# EAGLE design avga_TTH (EAGLE 7.5.0)
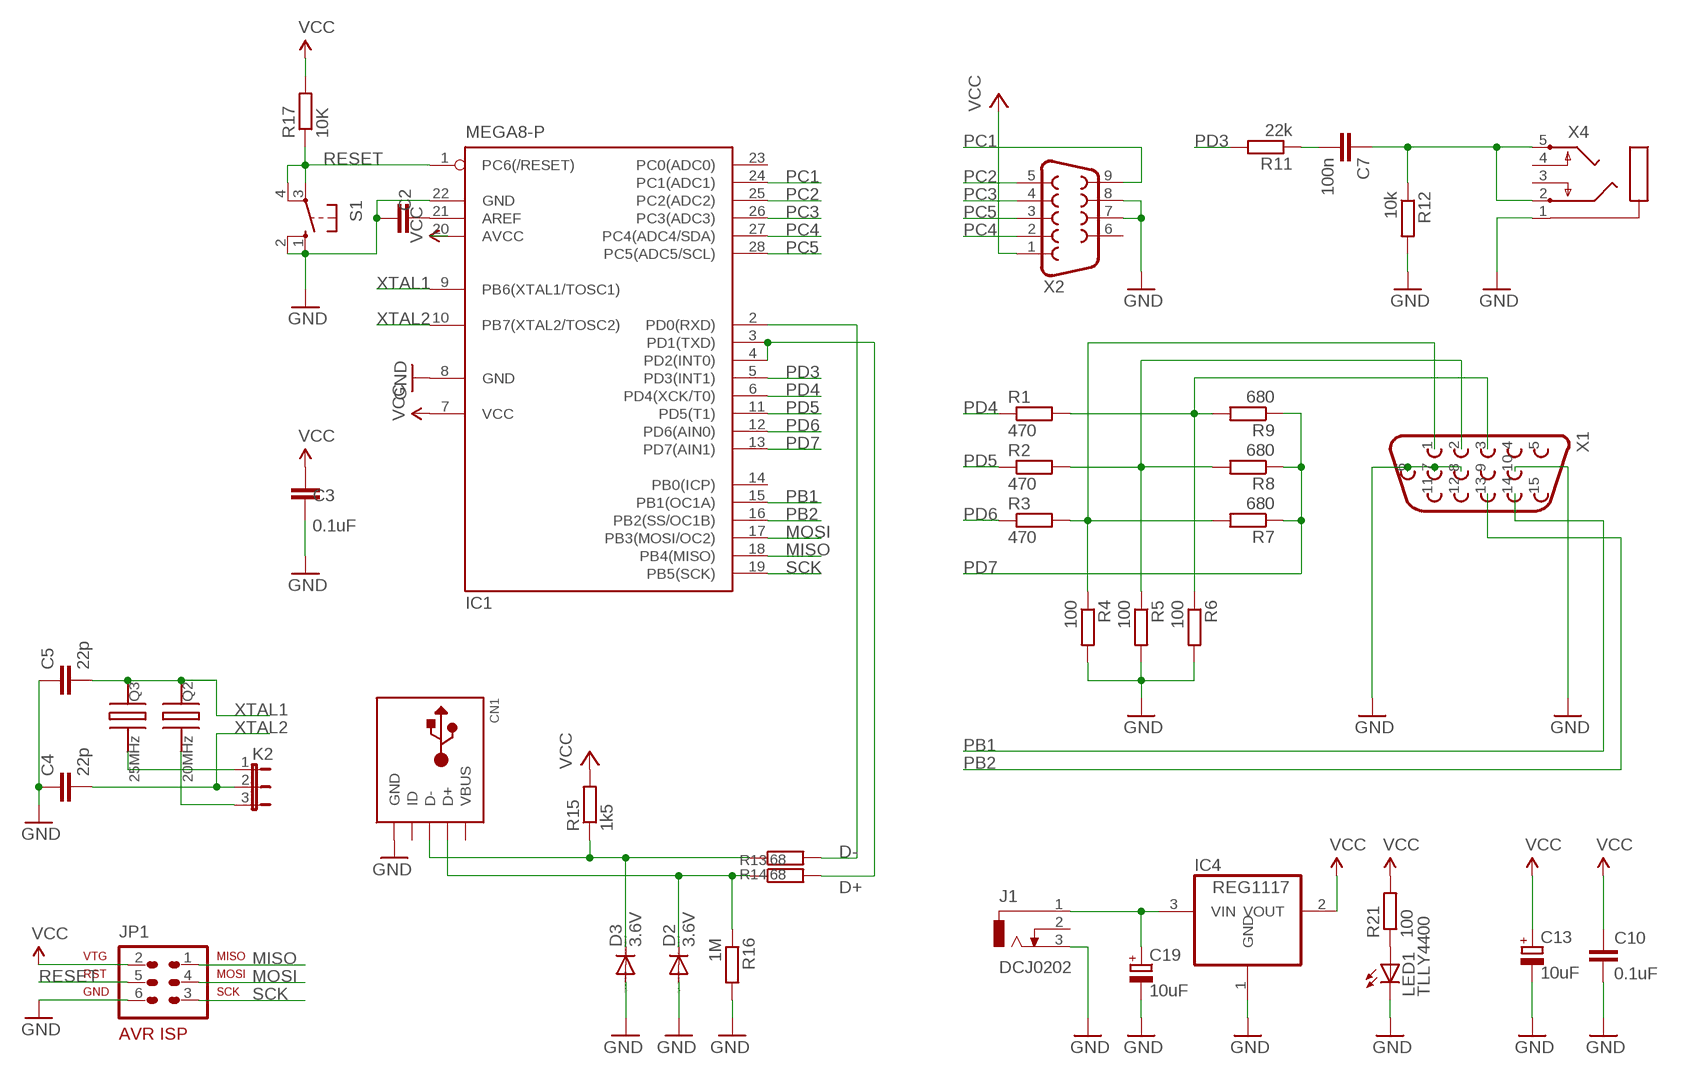
[diagram p0: schematic, sheet 1]

## Parts
C2  0.1uF  C-EUC0805  [C0805]
C3  0.1uF  C-EUC0805  [C0805]
C4  22p  C-EUC0805  [C0805]
C5  22p  C-EUC0805  [C0805]
C7  100n  C-EUC0805  [C0805]
C10  0.1uF  C-EUC0805  [C0805]
C13  10uF  CPOL-EUE2.5-5  [E2,5-5]
C19  10uF  CPOL-EUE2.5-5  [E2,5-5]
CN1  USBMINIB  [USB-MINIB]
D2  3.6V  DIODE-MINIMELF  [MINIMELF]
D3  3.6V  DIODE-MINIMELF  [MINIMELF]
IC1  MEGA8-P  [DIL28-3]
IC4  REG1117  [SOT223]
J1  DCJ0202  [DCJ0202]
JP1  AVR-ISP-6R  [AVR-ISP-6R]
K2  CON-3-POL  [MOLEX-PSK-03]
LED1  TLLY4400  [LED3MM]
Q2  20MHz  QUARZ  [QUARZ]
Q3  25MHz  QUARZ  [QUARZ]
R1  470  R-EU_R0805  [R0805]
R2  470  R-EU_R0805  [R0805]
R3  470  R-EU_R0805  [R0805]
R4  100  R-EU_R0805  [R0805]
R5  100  R-EU_R0805  [R0805]
R6  100  R-EU_R0805  [R0805]
R7  680  R-EU_R0805  [R0805]
R8  680  R-EU_R0805  [R0805]
R9  680  R-EU_R0805  [R0805]
R11  22k  R-EU_R0805  [R0805]
R12  10k  R-EU_R0805  [R0805]
R13  68  R-EU_R0805  [R0805]
R14  68  R-EU_R0805  [R0805]
R15  1k5  R-EU_R0805  [R0805]
R16  1M  R-EU_R0805  [R0805]
R17  10K  R-EU_R0805  [R0805]
R21  100  R-EU_R0805  [R0805]
S1  10-XX  [B3F-10XX]
X1  VGA-BU-15POL  [VGA-BU-15POL]
X2  D-SUB-ST-9POL  [M09HP]
X4  KLINKENBUCHSE  [KLINKENBUCHSE]

## Nets
B: R1.2 R6.1 R9.2 X1.3
G: R2.2 R5.1 R8.2 X1.2
GND: C2.2 C3.1 C4.1 C5.1 C10.2 C13.- C19.- CN1.GND D2.A D3.A IC1.8(GND) IC1.22(GND) IC4.1(GND) J1.3 JP1.6 LED1.K(C) R4.2 R5.2 R6.2 R12.2 R16.2 S1.1(S) S1.2(S1) X1.6 X1.7 X1.8 X1.10 X2.7 X2.8 X4.1
MISO: IC1.18(PB4(MISO)) JP1.1
MOSI: IC1.17(PB3(MOSI/OC2)) JP1.4
N$1: LED1.A R21.1
N$2: C7.1 R12.1 X4.2 X4.5
N$3: K2.1 Q3.2
N$11: CN1.D+ D2.C R13.1 R16.1
N$13: CN1.D- D3.C R14.1 R15.1
N$14: C7.2 R11.1
N$15: IC1.3(PD1(TXD)) IC1.4(PD2(INT0)) R13.2
N$16: IC1.2(PD0(RXD)) R14.2
N$19: K2.3 Q2.2
N$31: C2.1 IC1.21(AREF)
PB1: IC1.15(PB1(OC1A)) X1.14
PB2: IC1.16(PB2(SS/OC1B)) X1.13
PC1: IC1.24(PC1(ADC1)) X2.9
PC2: IC1.25(PC2(ADC2)) X2.5
PC3: IC1.26(PC3(ADC3)) X2.4
PC4: IC1.27(PC4(ADC4/SDA)) X2.2
PC5: IC1.28(PC5(ADC5/SCL)) X2.3
PD3: IC1.5(PD3(INT1)) R11.2
PD4: IC1.6(PD4(XCK/T0)) R1.1
PD5: IC1.11(PD5(T1)) R2.1
PD6: IC1.12(PD6(AIN0)) R3.1
PD7: IC1.13(PD7(AIN1)) R7.1 R8.1 R9.1
R: R3.2 R4.1 R7.2 X1.1
RESET: IC1.1(PC6(/RESET)) JP1.5 R17.1 S1.3(P) S1.4(P1)
SCK: IC1.19(PB5(SCK)) JP1.3
VCC: C3.2 C10.1 C13.+ IC1.7(VCC) IC1.20(AVCC) IC4.2(VOUT) JP1.2 R15.2 R17.2 R21.2 X2.1
VIN [vcc]: C19.+ IC4.3(VIN) J1.1
XTAL1: C5.2 IC1.9(PB6(XTAL1/TOSC1)) Q2.1 Q3.1
XTAL2: C4.2 IC1.10(PB7(XTAL2/TOSC2)) K2.2
Unconnected: CN1.ID IC1.14(PB0(ICP)) IC1.23(PC0(ADC0)) J1.2 X1.4 X1.5 X1.9 X1.11 X1.12 X1.15 X2.6 X4.3 X4.4

## Notes on the sheet
- D-
- D+

## Power pins joined to a net without a drawn wire
VBUS: CN1.VBUS

## Library data of the parts
C2 C3 = resistor:C-EU: CAPACITOR, European symbol
C4 C5 C7 C10 = rcl:C-EU: CAPACITOR, European symbol
C13 C19 = rcl:CPOL-EU: POLARIZED CAPACITOR, European symbol
CN1 = adafruit:USB: USB Connectors USBMINIB - Surface Mount Female Mini-B USB Connector 4UConnector: 06564 By microbuilder.eu Thru-hole RA Female Mini-B USB Connector 4UConnector: 18732 By ladyada.net
D2 D3 = diode:DIODE-: DIODE
IC1 = atmel:MEGA8-P: MICROCONTROLLER 8 Kbytes FLASH, 1 kbytes SRAM, 512 bytes EEPROM, USART, 4-channel 10 bit ADC, 2-channel 8 bit ADC Pin compatible with Atmega48, ATMega88, ATMega168 Source: avr.lbr; OC_FARNELL: unknown; OC_NEWARK: unknown
IC4 = burr-brown:REG1117: 800mA and 1A Low Dropout (LDO) Positive Regulator 1.8V, 2.5V, 2.85V, 3.3V, 5V, and Adj; MPN: REG1117; OC_FARNELL: 1097566; OC_NEWARK: 14P6981
J1 = con-jack-igi:DCJ0202: DC POWER JACK Source: DCJ0202.pdf; OC_FARNELL: unknown; OC_NEWARK: unknown
JP1 = avr-6:AVR-ISP-6: AVR ISP-6 Serial Programming Header
K2 = usbswitchboard:CON-3-POL: JST Stiftleiste B3B-EH-A
LED1 = led-igi:TLLY4400: Low Current (2mA) LED 3 mm Tinted Diffused Package color YELLOW Source: Data sheet <http://www.farnell.com/datasheets/391098.pdf>; MF: VISHAY SEMICONDUCTOR; OC_FARNELL: 1612439
Q2 Q3 = pacman:QUARZ: Quarz
R1-R9 R11-R16 = rcl:R-EU_: RESISTOR, European symbol
R17 R21 = resistor:R-EU_: RESISTOR, European symbol
S1 = switch-omron:10-XX: OMRON SWITCH; MPN: B3F-1000; OC_FARNELL: 176432; OC_NEWARK: 36M3542
X1 = usbboard:VGA-BU-15POL: VGA-Buchse 15pol
X2 = pacman:D-SUB-ST-9POL: D-SUB-Stecker, 9-polig, gewinkelt, RM 9,4
X4 = usbboard:KLINKENBUCHSE: Klinkenbuchse 3,5mm stereo

## Net classes
1 vcc: width 0.254 mm

## Board
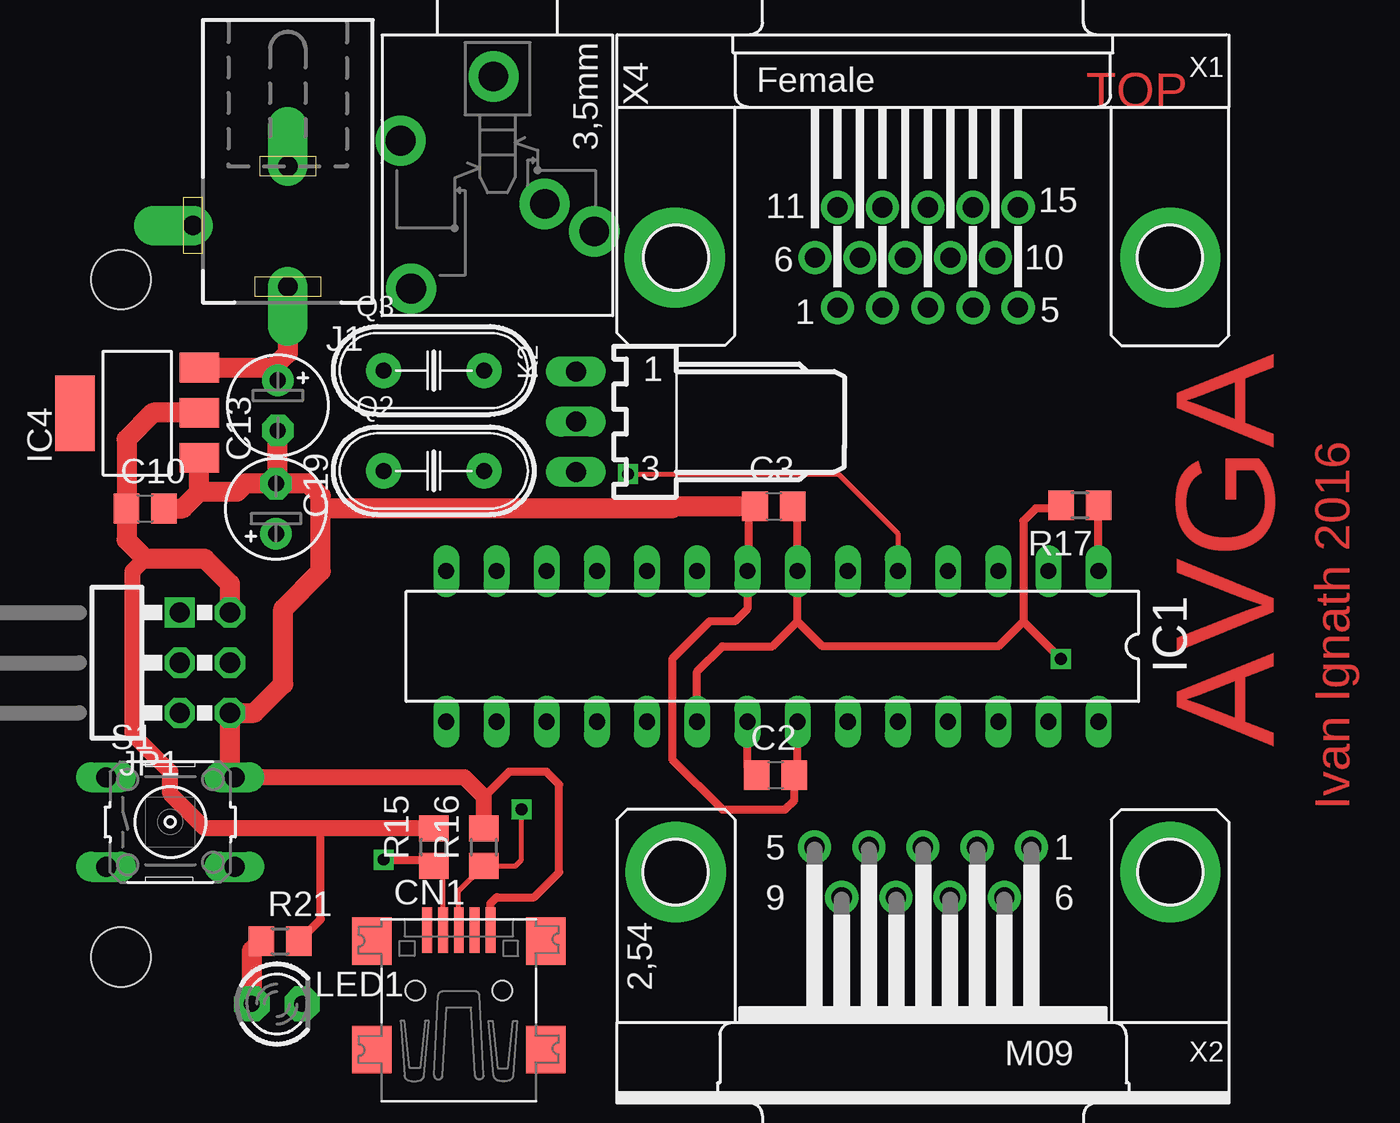
[diagram p1: board, top side]
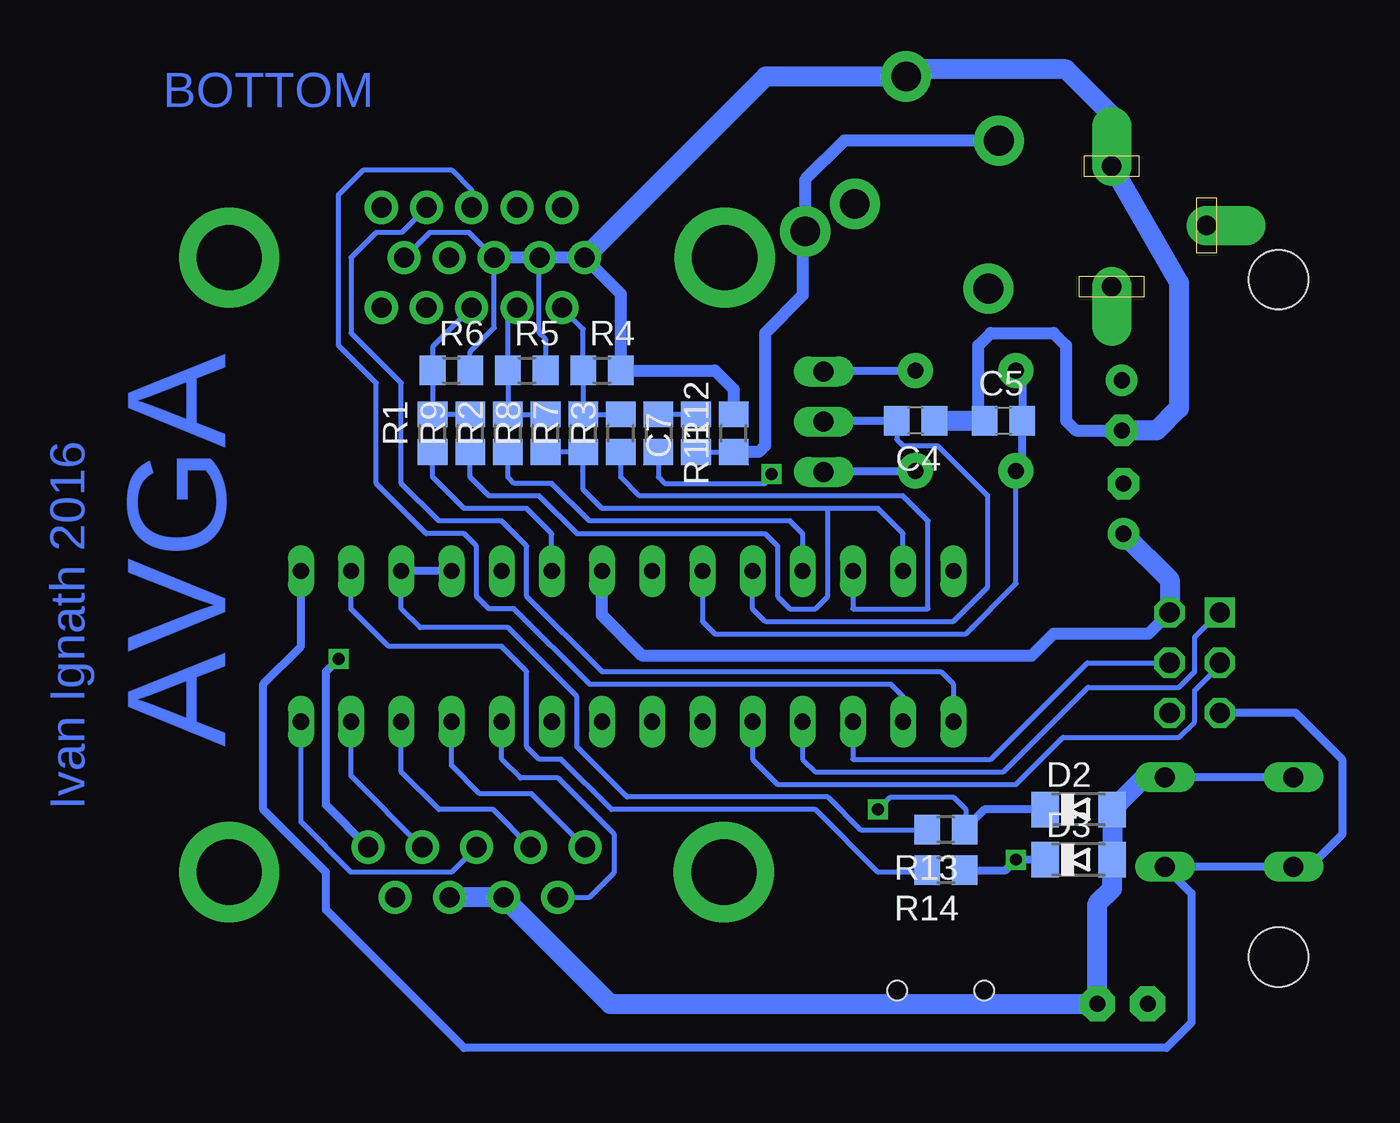
[diagram p2: board, bottom side, seen from below]

No outline drawn. Coordinates in mm, seen from the top.
Copper layers (1*16): Top 0.035mm / dielectric 1.5mm / Bottom 0.035mm
Design rules "default": minimum track width 10mil, minimum drill 24mil, track to track 8mil, track to pad 8mil, pad to pad 8mil, via to via 8mil, smd to smd 8mil, copper to edge 40mil, drill to drill 8mil, minimum pad ring 10mil, minimum via ring 8mil, stop-mask expansion 4mil, vias tented up to drill 0mil, thermal gap 10mil
Holes 3 mm at 77.77,5.87 3.86,5.87 77.77,40.16 3.86,40.16

### Footprints (pad centres in the part's own frame; a part is rotated, then mirrored left to right if it is on the bottom)
C0805 = smd 1.3 x 1.5: 1 -0.95,0; 2 0.95,0
E2,5-5 = drill 0.813 pad 1.6: + -1.27,0 | drill 0.813 pad 1.6 octagon: - 1.27,0
USB-MINIB = smd 0.5 x 2.308: D+ 0,4.064; D- -0.8,4.064; GND 1.6,4.064; ID 0.8,4.064; VBUS -1.6,4.064 | smd 2 x 2.4: GND1 -4.4,-2; GND2 -4.4,3.5; GND3 4.4,3.5; GND4 4.4,-2 | hole 1: -2.2,1; 2.2,1
MINIMELF = smd 1.4 x 1.8: A 1.7,0; C -1.7,0
DIL28-3 = drill 0.813 long: 1 -16.51,-3.81; 2 -13.97,-3.81; 3 -11.43,-3.81; 4 -8.89,-3.81; 5 -6.35,-3.81; 6 -3.81,-3.81; 7 -1.27,-3.81; 8 1.27,-3.81; 9 3.81,-3.81; 10 6.35,-3.81; 11 8.89,-3.81; 12 11.43,-3.81; 13 13.97,-3.81; 14 16.51,-3.81; 15 16.51,3.81; 16 13.97,3.81; 17 11.43,3.81; 18 8.89,3.81; 19 6.35,3.81; 20 3.81,3.81; 21 1.27,3.81; 22 -1.27,3.81; 23 -3.81,3.81; 24 -6.35,3.81; 25 -8.89,3.81; 26 -11.43,3.81; 27 -13.97,3.81; 28 -16.51,3.81
SOT223 = smd 1.499 x 2.007: 1 -2.261,-3.15; 2 0.025,-3.15; 3 2.311,-3.15 | smd 3.81 x 2.007: 4 0,3.15
DCJ0202 = drill 1 pad 2 offset: 1 0,3.1; 2 4.8,0; 3 0,-3
AVR-ISP-6R = drill 1.016 square: 1 -2.54,-1.27 | drill 1.016 octagon: 2 -2.54,1.27; 3 0,-1.27; 4 0,1.27; 5 2.54,-1.27; 6 2.54,1.27
MOLEX-PSK-03 = drill 1.016 long: 1 2.54,0; 2 0,0; 3 -2.54,0
LED3MM = drill 0.813 pad 1.778 octagon: A -1.27,0; K 1.27,0
QUARZ = drill 0.813 pad 1.778: 1 0,0; 2 5.08,0
R0805 = smd 1.3 x 1.5: 1 -0.95,0; 2 0.95,0
B3F-10XX = drill 1.016 long: 1 -3.251,2.261; 2 3.251,2.261; 3 -3.251,-2.261; 4 3.251,-2.261
VGA-BU-15POL = drill 1.016 pad 1.676: 1 4.329,2.54; 2 2.043,2.54; 3 -0.243,2.54; 4 -2.54,2.529; 5 -4.815,2.54; 6 5.472,0; 7 3.186,0; 8 0.9,0; 9 -1.386,0; 10 -3.672,0; 11 4.329,-2.54; 12 2.043,-2.54; 13 -0.243,-2.54; 14 -2.529,-2.54; 15 -4.815,-2.54 | drill 3.302 pad 5.08: G1 -12.522,0; G3 12.56,0
M09HP = drill 1.016 pad 1.676: 1 -5.486,-1.27; 2 -2.743,-1.27; 3 0,-1.27; 4 2.743,-1.27; 5 5.486,-1.27; 6 -4.115,1.27; 7 -1.372,1.27; 8 1.372,1.27; 9 4.115,1.27 | drill 3.302 pad 5.08: G1 -12.522,0; G2 12.522,0
KLINKENBUCHSE = drill 1.499 pad 2.54: 1 -5.004,-0.203; 2 2.845,4.902; 3 1.448,2.388; 4 5.74,-4.369; 5 -1.753,-4.902

### Placement (x,y rotation side)
C2  36.99,15.08 0 top
C3  36.9,28.68 0 top
C4  22.23,33.02 180 bottom
C5  17.78,33.02 0 bottom
C7  33.34,32.38 90 bottom
C10  5.08,28.57 0 top
C13  11.7,28.56 90 top
C19  11.79,33.79 270 top
CN1  20.95,3.17 0 top
D2  13.97,13.34 0 bottom
D3  13.97,10.79 0 bottom
IC1  36.83,21.59 180 top
IC4  4.67,33.4 90 top
J1  12.3,42.9 180 top
JP1  8.1,20.77 270 top
K2  26.88,32.97 90 top
LED1  11.75,3.49 0 top
Q2  17.14,30.48 0 top
Q3  17.14,35.56 0 top
R1  46.67,32.38 90 bottom
R2  42.86,32.38 90 bottom
R3  37.15,32.38 90 bottom
R4  38.1,35.56 0 bottom
R5  41.91,35.56 0 bottom
R6  45.72,35.56 0 bottom
R7  39.05,32.38 90 bottom
R8  40.96,32.38 90 bottom
R9  44.77,32.38 90 bottom
R11  35.24,32.38 270 bottom
R12  31.43,32.38 90 bottom
R13  20.7,12.32 180 bottom
R14  20.69,10.26 180 bottom
R15  19.68,11.43 90 top
R16  22.23,11.43 90 top
R17  52.39,28.73 180 top
R21  11.91,6.67 0 top
S1  6.35,12.7 0 top
X1  44.45,41.27 180 top
X2  44.45,10.16 180 top
X4  22.91,45.44 270 top

### Tracks (layer width: path | path; a pad name or v marks a point on that pad's centre or on a via)
B
  Bottom 0.254: R9.2 R1.2 R6.1 46.67,36.76 X1.3
G
  Bottom 0.254: R8.2 R2.2 R5.1 42.86,38.28 X1.2
GND
  Top 0.254: 35.63,25.47 IC1.8
  Top 0.406: 35.63,25.47 35.63,28.37 C3.1 | IC1.22 38.1,15.24 arc-90 C2.2 37.94,13.81 37.47,13.34 34.29,13.34 31.75,15.88 31.75,20.95 33.66,22.86 34.92,22.86 35.56,23.5 IC1.8 | CN1.GND 22.55,8.57 22.87,8.89 24.77,8.89 26.04,10.16 26.04,14.61 25.4,15.24 23.5,15.24 22.23,13.97
  Top 0.813: R16.2 22.23,13.97 21.23,14.96 S1.2
  Top 1.016: C10.2 6.99,28.57 7.82,29.41 | 7.82,29.41 IC4.1 | 11.69,29.84 C13.- 11.71,29.84 13.34,29.84 13.97,29.21 13.97,28.57 | 11.69,29.84 10.16,29.84 9.73,29.41 7.82,29.41 | 11.69,29.84 11.79,29.95 C19.- | 13.97,28.57 13.97,25.4 12.06,23.5 12.06,19.68 10.61,18.23 JP1.6 9.37,15.2 S1.2 | C3.1 31.86,28.68 31.75,28.57 13.97,28.57
  Bottom 0.254: R5.2 40.96,37.15 41.27,37.47 41.27,41.26 X1.7 | R4.2 37.31,35.72 | X1.10 48.1,41.27 46.83,42.55 44.82,42.55 X1.8 43.55,37.73 44.77,36.51 R6.2 | R12.2 31.11,33.65
  Bottom 0.406: S1.1 S1.2 10.64,14.96
  Bottom 0.61: R12.2 31.43,34.61 32.38,35.56 R4.2 37.15,39.45 X1.6 X1.7 X1.8 | C5.1 19.05,33.34 19.05,36.83 18.41,37.47 15.24,37.47 14.61,36.83 14.61,33.02 14.11,32.52 C19.-
  Bottom 1.016: J1.3 12.52,45.9 | J1.3 12.3,48.49 14.61,50.8 22.35,50.8 X4.1 29.8,50.45 X1.6 | J1.3 8.89,40.01 8.89,33.66 10.02,32.52 C19.- | C4.1 C5.1 | 10.64,14.96 D2.A D3.A 12.27,9.32 13.02,8.57 LED1.K 37.68,3.49 X2.8 X2.7
MISO
  Bottom 0.254: IC1.18 27.94,15.88 27.3,15.24 17.78,15.24 13.49,19.53 8.89,19.53 8.1,20.32 8.1,22.07 6.86,23.31 JP1.1
MOSI
  Bottom 0.254: IC1.17 25.4,15.88 18.41,15.88 13.52,20.77 JP1.4
N$1
  Top 1.016: R21.1 10.48,6.19 LED1.A
N$2
  Bottom 0.254: C7.1 R12.1
  Bottom 0.61: X4.5 25.83,47.2 27.81,45.21 X4.2 27.94,42.47 27.94,39.37 29.84,37.47 29.84,31.75 30.16,31.43 R12.1
N$3
  Bottom 0.406: K2.1 26.83,35.56 Q3.2
N$11  (via drill 0.6)
  Top 0.254: CN1.D+ 20.95,9.21 R16.1 23.82,10.48 24.13,10.79 v24.13,13.34
  Bottom 0.254: 19.5,12.06 R13.1 19.68,12.38 19.68,13.34 20.32,13.97 23.5,13.97 v24.13,13.34
  Bottom 0.406: D2.C 18.73,13.34 R13.1
N$13  (via drill 0.6)
  Top 0.254: CN1.D- 20.16,10.01 R15.1
  Top 0.406: v17.14,10.79 19.37,10.79 R15.1
  Bottom 0.406: D3.C v17.14,10.79 17.68,10.26 R14.1
N$14
  Bottom 0.254: C7.2 R11.1
N$15
  Bottom 0.254: R13.2 25.02,12.31 26.67,13.97 36.83,13.97 39.37,16.51 39.37,19.05 42.86,22.54 47.31,22.54 48.26,23.5 IC1.3
  Bottom 0.406: IC1.4 IC1.3
N$16
  Bottom 0.254: R14.2 21.75,10.16 24.13,10.16 27.3,13.34 37.62,13.34 40.16,15.88 41.27,15.88 41.91,16.51 41.91,20.32 43.18,21.59 48.9,21.59 50.8,23.5 IC1.2
N$19
  Bottom 0.406: K2.3 26.83,30.48 Q2.2
N$31
  Top 0.406: C2.1 arc-90 35.56,15.56 IC1.21
PB1
  Bottom 0.254: X1.14 48.25,42.55 49.53,42.55 50.8,41.27 50.8,37.47 48.26,34.92 48.26,29.84 46.35,27.94 43.18,27.94 41.91,26.67 41.91,24.13 38.1,20.32 20.95,20.32 20.32,19.68 IC1.15
PB2
  Bottom 0.254: X1.13 44.69,44.69 45.72,45.72 50.16,45.72 51.44,44.45 51.44,36.83 49.53,34.92 49.53,29.84 46.99,27.3 45.09,27.3 44.45,26.67 44.45,24.13 43.81,23.5 42.55,23.5 38.73,19.68 23.5,19.68 22.86,19.05 IC1.16
PC1
  Bottom 0.254: X2.9 38.73,8.89 37.47,10.16 37.47,12.06 40.32,14.92 42.23,14.92 43.18,15.88 IC1.24
PC2
  Bottom 0.254: X2.5 41.66,14.13 44.29,14.13 45.72,15.56 IC1.25
PC3
  Bottom 0.254: X2.4 43.61,13.34 46.35,13.34 48.26,15.24 IC1.26
PC4
  Bottom 0.254: X2.2 50.8,15.04 IC1.27
PC5
  Bottom 0.254: 44.44,11.44 X2.3 45.72,10.16 50.8,10.16 53.34,12.7 IC1.28
PD3  (via drill 0.6)
  Top 0.254: v29.53,30.32 40.16,30.32 43.18,27.3 IC1.5
  Bottom 0.254: R11.2 35.24,30.16 34.92,29.84 29.84,29.84 29.53,30.16 v29.53,30.32
PD4
  Bottom 0.254: IC1.6 40.64,27.3 41.91,28.57 45.09,28.57 46.67,30.16 R1.1 46.99,31.12 46.99,31.11
PD5
  Bottom 0.254: R2.1 42.55,31.12 | IC1.11 27.94,27.3 28.57,27.94 38.73,27.94 40.64,29.84 42.55,29.84 42.86,30.16 R2.1 | 43.18,31.11 43.18,31.12 R2.1
PD6
  Bottom 0.254: IC1.12 25.4,23.5 21.59,23.5 21.59,27.94 22.86,29.21 36.2,29.21 37.15,30.16 R3.1
PD7
  Bottom 0.254: R8.1 R7.1 39.05,29.53 38.1,28.57 26.67,28.57 | IC1.13 22.86,27.3 24.13,28.57 26.67,28.57 | 26.67,28.57 26.67,24.13 27.3,23.5 28.57,23.5 29.21,24.13 29.21,26.67 29.84,27.3 39.37,27.3 41.27,29.21 43.81,29.21 44.77,30.16 R9.1 45.09,31.12 45.09,31.11
R
  Bottom 0.254: R3.2 R7.2 R4.1 39.05,37.67 X1.1
RESET
  Top 0.406: IC1.1 R17.1
  Bottom 0.406: JP1.5 2.99,18.23 0.64,15.88 0.64,12.06 2.26,10.44 S1.3 S1.4 8.26,9.09 8.26,2.54 9.53,1.27 45.09,1.27 52.07,8.26 52.07,10.16 55.24,13.34 55.24,19.68 53.34,21.59 IC1.1
SCK
  Bottom 0.254: IC1.19 30.48,15.88 29.21,14.61 17.14,14.61 14.76,16.99 8.89,16.99 8.1,17.78 8.1,19.37 6.83,20.64 JP1.3
VCC  (via drill 0.6)
  Top 0.406: IC1.20 33.02,20.32 34.29,21.59 36.83,21.59 38.1,22.86 | 38.1,22.86 IC1.7 38.1,28.43 C3.2 | R17.2 51.28,28.57 50.16,28.57 49.53,27.94 49.53,22.86 | 49.53,22.86 48.26,21.59 39.37,21.59 38.1,22.86 | R21.2 13.97,7.78 13.97,12.38 | v51.44,20.95 49.53,22.86
  Top 0.813: R15.2 13.97,12.38 8.1,12.38 6.35,14.13 6.35,15.24 4.45,17.14 4.45,25.4 5.08,26.04
  Top 1.016: IC4.2 5.48,33.42 4.13,32.07 C10.1 4.13,26.98 5.08,26.04 8.1,26.04 9.37,24.77 JP1.2
  Bottom 0.406: X2.1 52.07,13.56 52.07,20.32 v51.44,20.95
  Bottom 0.61: JP1.2 10.45,22.23 15.24,22.23 16.35,21.11 36.04,21.11 38.1,23.18 IC1.7
  Bottom 1.016: C13.+ 9.37,24.96 JP1.2
VIN
  Top 1.016: IC4.3 11.15,35.71 11.36,35.49 | 11.36,35.49 C19.+ | J1.1 12.3,36.43 11.36,35.49
XTAL1
  Bottom 0.254: IC1.9 33.02,22.86 32.38,22.23 19.68,22.23 17.14,24.77 Q2.1
  Bottom 0.406: Q3.1 16.83,35.24 C5.2 16.83,30.8 Q2.1
XTAL2
  Bottom 0.254: C4.2 23.18,32.07 22.86,31.75 21.11,31.75 18.57,29.21 18.57,24.61 20.32,22.86 29.84,22.86 30.48,23.5 IC1.10
  Bottom 0.406: K2.2 26.83,33.02 C4.2

### Text on the board
Top: TOP | AVGA | Ivan Ignath 2016
Bottom: BOTTOM | AVGA | Ivan Ignath 2016